# EAGLE design Smart Home (EAGLE 9.6.2)
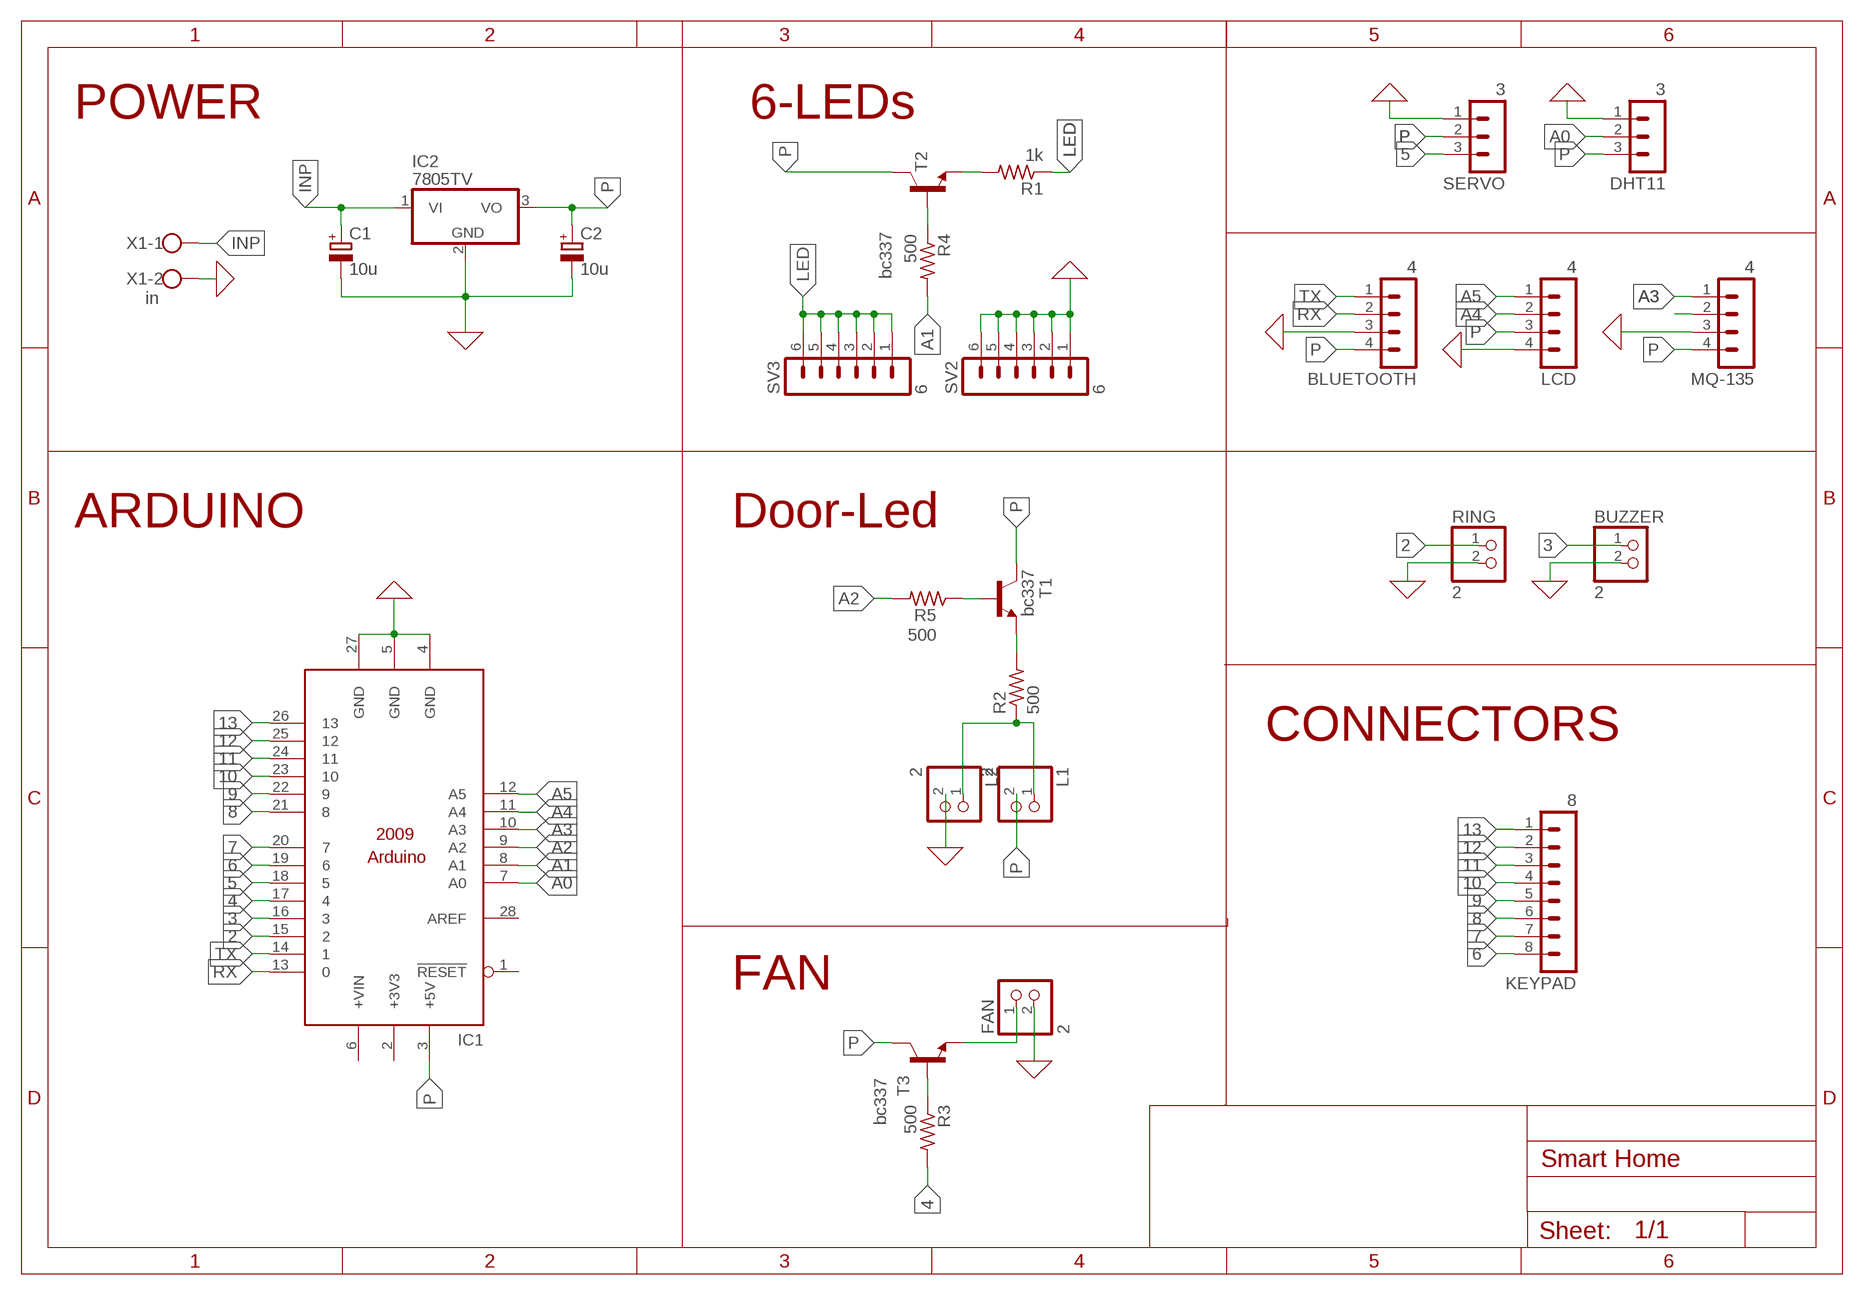
[diagram p0: schematic, sheet 1]

## Parts
BLUETOOTH  4  MA04-1  [MA04-1]
BUZZER  2  PINHD-1X2  [1X02]
C1  10u  CPOL-EUE2.5-6  [E2,5-6]
C2  10u  CPOL-EUE2.5-6  [E2,5-6]
DHT11  3  MA03-1  [MA03-1]
FAN  2  PINHD-1X2  [1X02]
IC1  uno  ARDUINO2009_12  [ARDUINO2009_2]
IC2  7805TV  [TO220V]
KEYPAD  8  MA08-1  [MA08-1]
L1  2  PINHD-1X2  [1X02]
L2  2  PINHD-1X2  [1X02]
LCD  4  MA04-1  [MA04-1]
MQ-135  4  MA04-1  [MA04-1]
R1  1k  R-US_0207/10  [0207/10]
R2  500  R-US_0207/10  [0207/10]
R3  500  R-US_0207/10  [0207/10]
R4  500  R-US_0207/10  [0207/10]
R5  500  R-US_0207/10  [0207/10]
RING  2  PINHD-1X2  [1X02]
SERVO  3  MA03-1  [MA03-1]
SV2  6  MA06-1  [MA06-1]
SV3  6  MA06-1  [MA06-1]
T1  bc337  BC337-16-NPN-TO92-CBE  [TO92-CBE]
T2  bc337  BC337-16-NPN-TO92-CBE  [TO92-CBE]
T3  bc337  BC337-16-NPN-TO92-CBE  [TO92-CBE]
X1  in  W237-102  [W237-102]

## Nets
0: BLUETOOTH.3 BUZZER.2 C1.- C2.- DHT11.1 FAN.2 IC1.4(GND) IC1.5(GND) IC1.27(GND) IC2.2(GND) L2.2 LCD.4 MQ-135.3 RING.2 SERVO.1 SV2.1 SV2.2 SV2.3 SV2.4 SV2.5 SV2.6 X1.2 ; supply symbol labelled GND
2: IC1.15 RING.1
3: BUZZER.1 IC1.16
4: IC1.17 R3.2
5: IC1.18 SERVO.3
6: IC1.19 KEYPAD.8
7: IC1.20 KEYPAD.7
8: IC1.21 KEYPAD.6
9: IC1.22 KEYPAD.5
10: IC1.23 KEYPAD.4
11: IC1.24 KEYPAD.3
12: IC1.25 KEYPAD.2
13: IC1.26 KEYPAD.1
A0: DHT11.2 IC1.7(A0)
A1: IC1.8(A1) R4.2
A2: IC1.9(A2) R5.2
A3: IC1.10(A3) MQ-135.1
A4: IC1.11(A4) LCD.2
A5: IC1.12(A5) LCD.1
INP: C1.+ IC2.1(VI) X1.1
L1: L1.1 L2.1 R2.1
LED: R1.1 SV3.1 SV3.2 SV3.3 SV3.4 SV3.5 SV3.6
N$1: R1.2 T2.E
N$2: R2.2 T1.E
N$3: FAN.1 T3.E
N$4: MQ-135.2
N$5: R5.1 T1.B
N$6: R4.1 T2.B
N$7: R3.1 T3.B
P: BLUETOOTH.4 C2.+ DHT11.3 IC1.3(+5V) IC2.3(VO) L1.2 LCD.3 MQ-135.4 SERVO.2 T1.C T2.C T3.C
RX: BLUETOOTH.2 IC1.13
TX: BLUETOOTH.1 IC1.14
Unconnected: IC1.1(!RESET) IC1.6(+VIN) IC1.28(AREF)

## Notes on the sheet
- POWER | 6-LEDs
- ARDUINO | Door-Led
- CONNECTORS
- FAN

## Power pins joined to a net without a drawn wire
+3V3: IC1.2(+3V3)

## Library data of the parts
BLUETOOTH LCD MQ-135 = con-lstb:MA04-1: PIN HEADER; OC_FARNELL: unknown; OC_NEWARK: unknown
BUZZER FAN L1 L2 RING = pinhead:PINHD-1X2: PIN HEADER
C1 C2 = rcl:CPOL-EU: POLARIZED CAPACITOR, European symbol; SPICEPREFIX: C
DHT11 SERVO = con-lstb:MA03-1: PIN HEADER; OC_FARNELL: unknown; OC_NEWARK: unknown
IC1 = arduino:ARDUINO2009_1: The Arduino Duemilanove ("2009") is a microcontroller board based on the ATmega168 or ATmega328. - 14 digital input/output pins (of which 6 can be used as PWM outputs) - 6 analog inputs, a 16 MHz crystal oscillator - USB connection - power jack - ISP header - reset button It contains everything needed to support the microcontroller; simply connect it to a computer with a USB cable or power it with a AC-to-DC adapter or battery to get started http://arduino.cc/en/Main/ArduinoBoardDuemilanove
IC2 = linear:78*: Positive VOLTAGE REGULATOR Source: http://cache.national.com/ds/LM/LM78L05.pdf http://www.fairchildsemi.com/ds/LM/LM7805.pdf
KEYPAD = con-lstb:MA08-1: PIN HEADER; OC_FARNELL: unknown; OC_NEWARK: unknown
R1-R5 = rcl:R-US_: RESISTOR, American symbol; SPICEPREFIX: R
SV2 SV3 = con-lstb:MA06-1: PIN HEADER; OC_FARNELL: unknown; OC_NEWARK: unknown
T1-T3 = transistor:*-NPN-: NPN Transistror BF959 corrected 2008.03.06
X1 = con-wago-500:W237-102: WAGO SCREW CLAMP; MPN: 237-102; OC_FARNELL: unknown; OC_NEWARK: 70K9898

## Net classes
0 default: width 1.397 mm

## Board
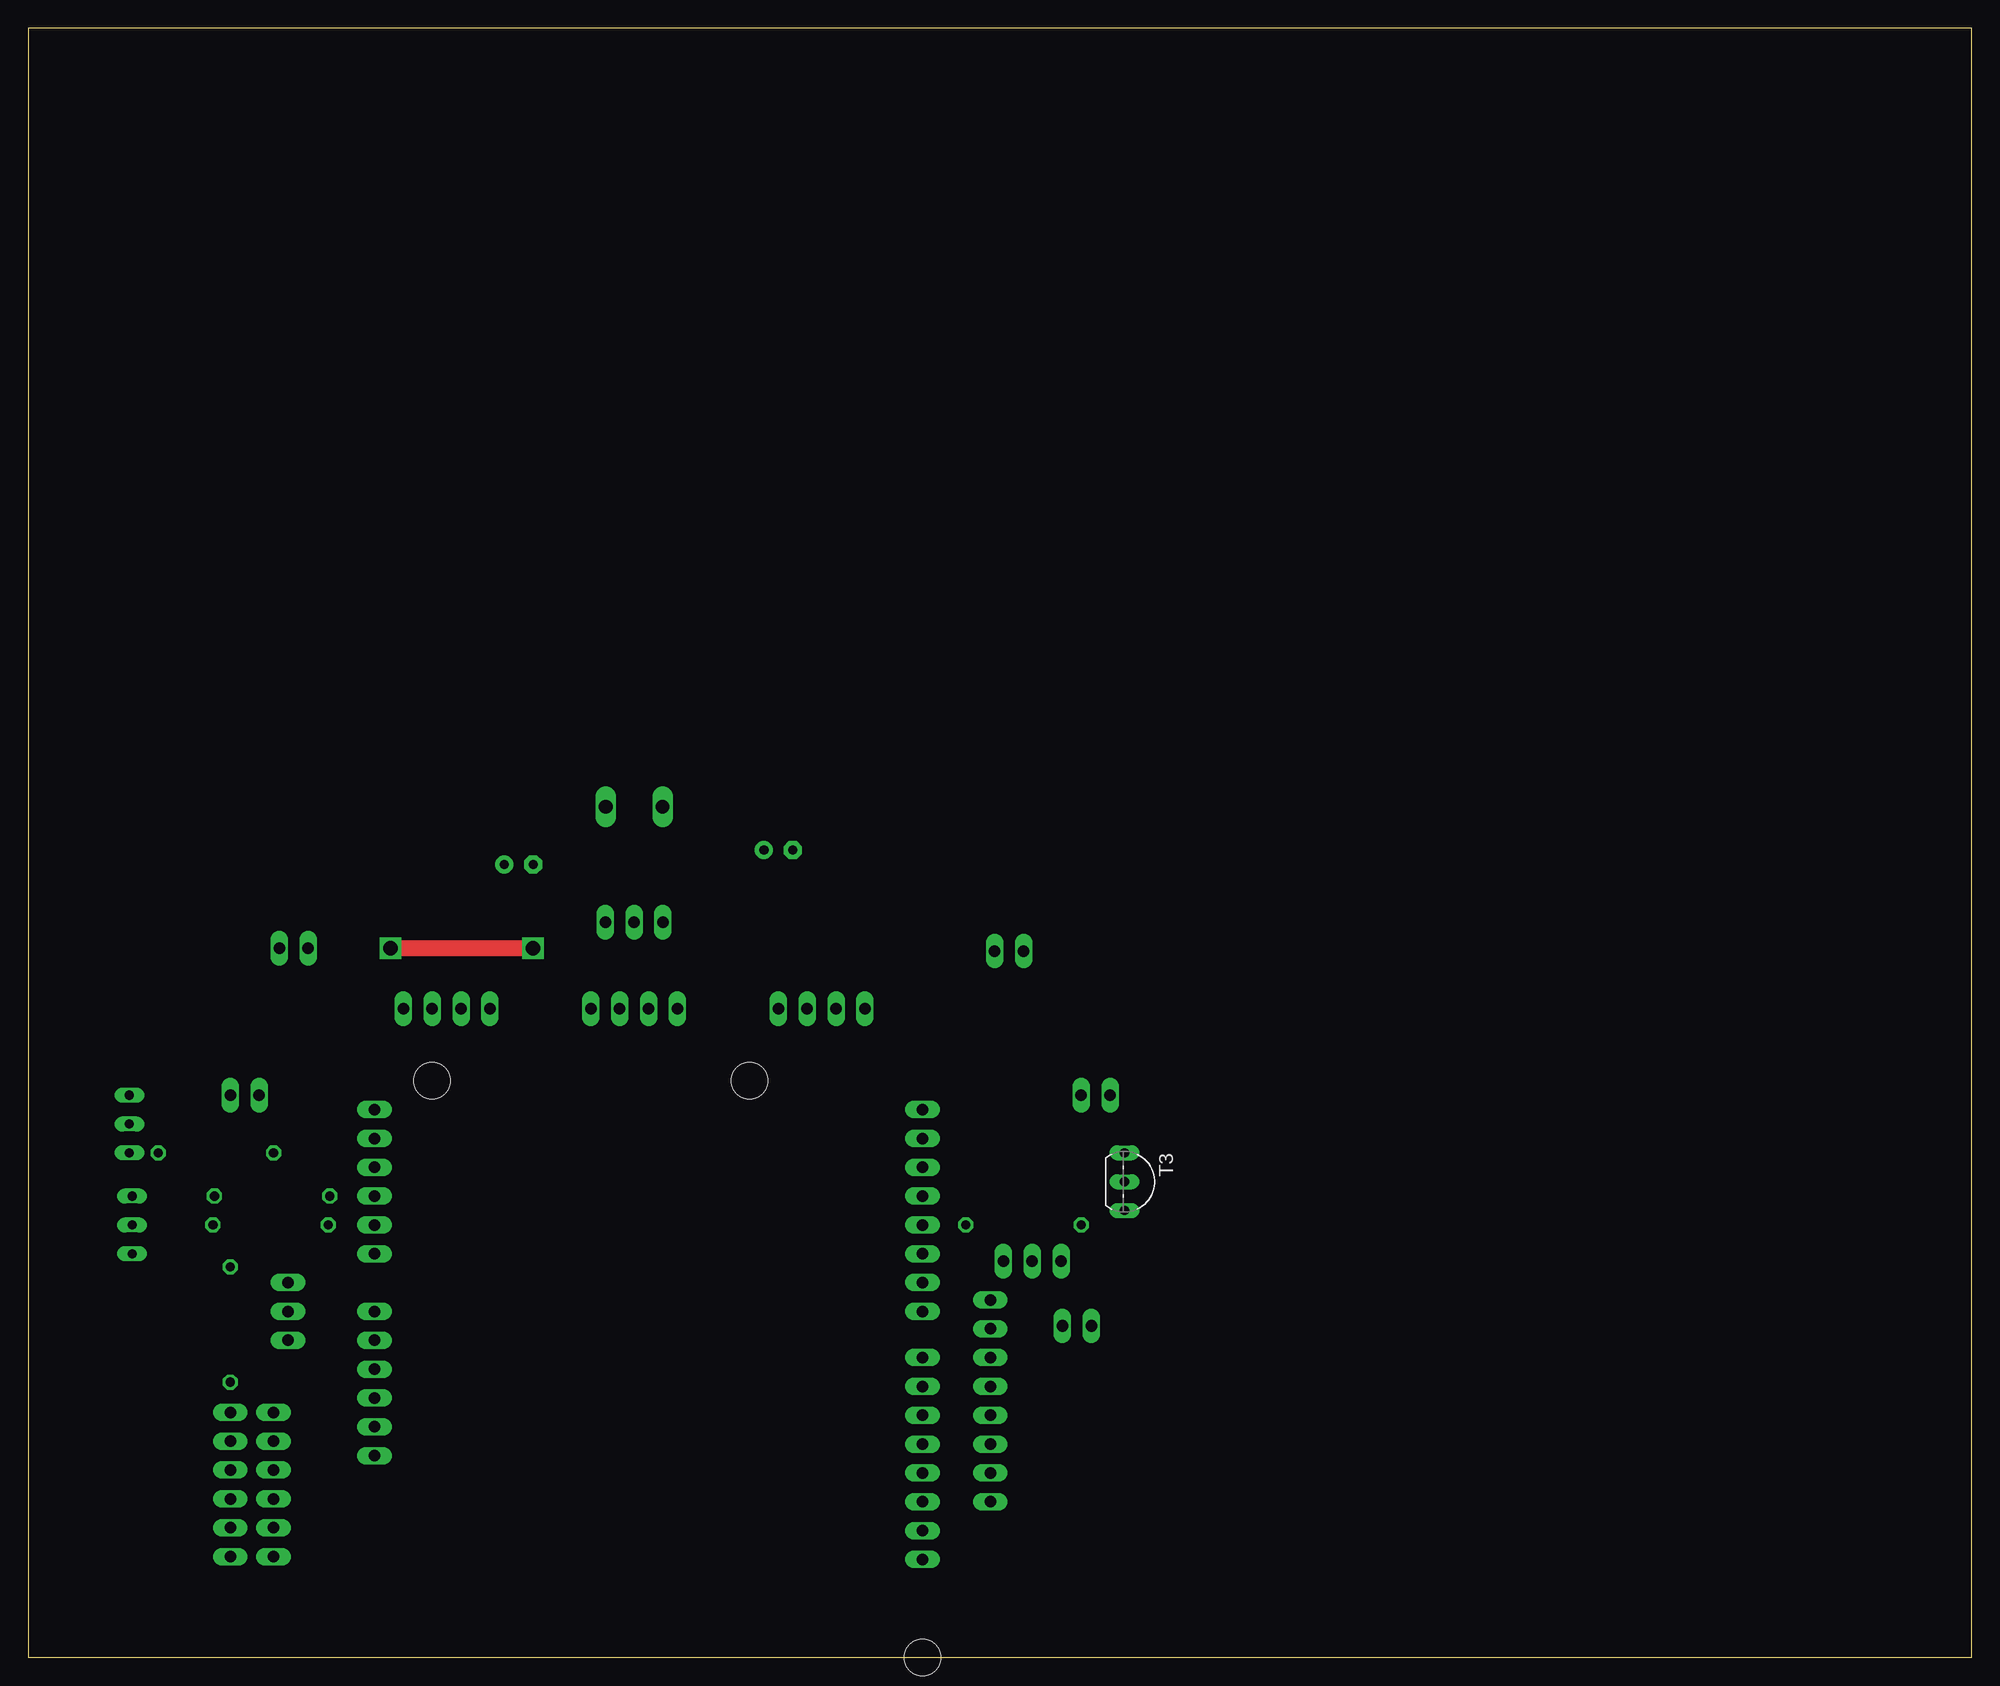
[diagram p1: board, top side]
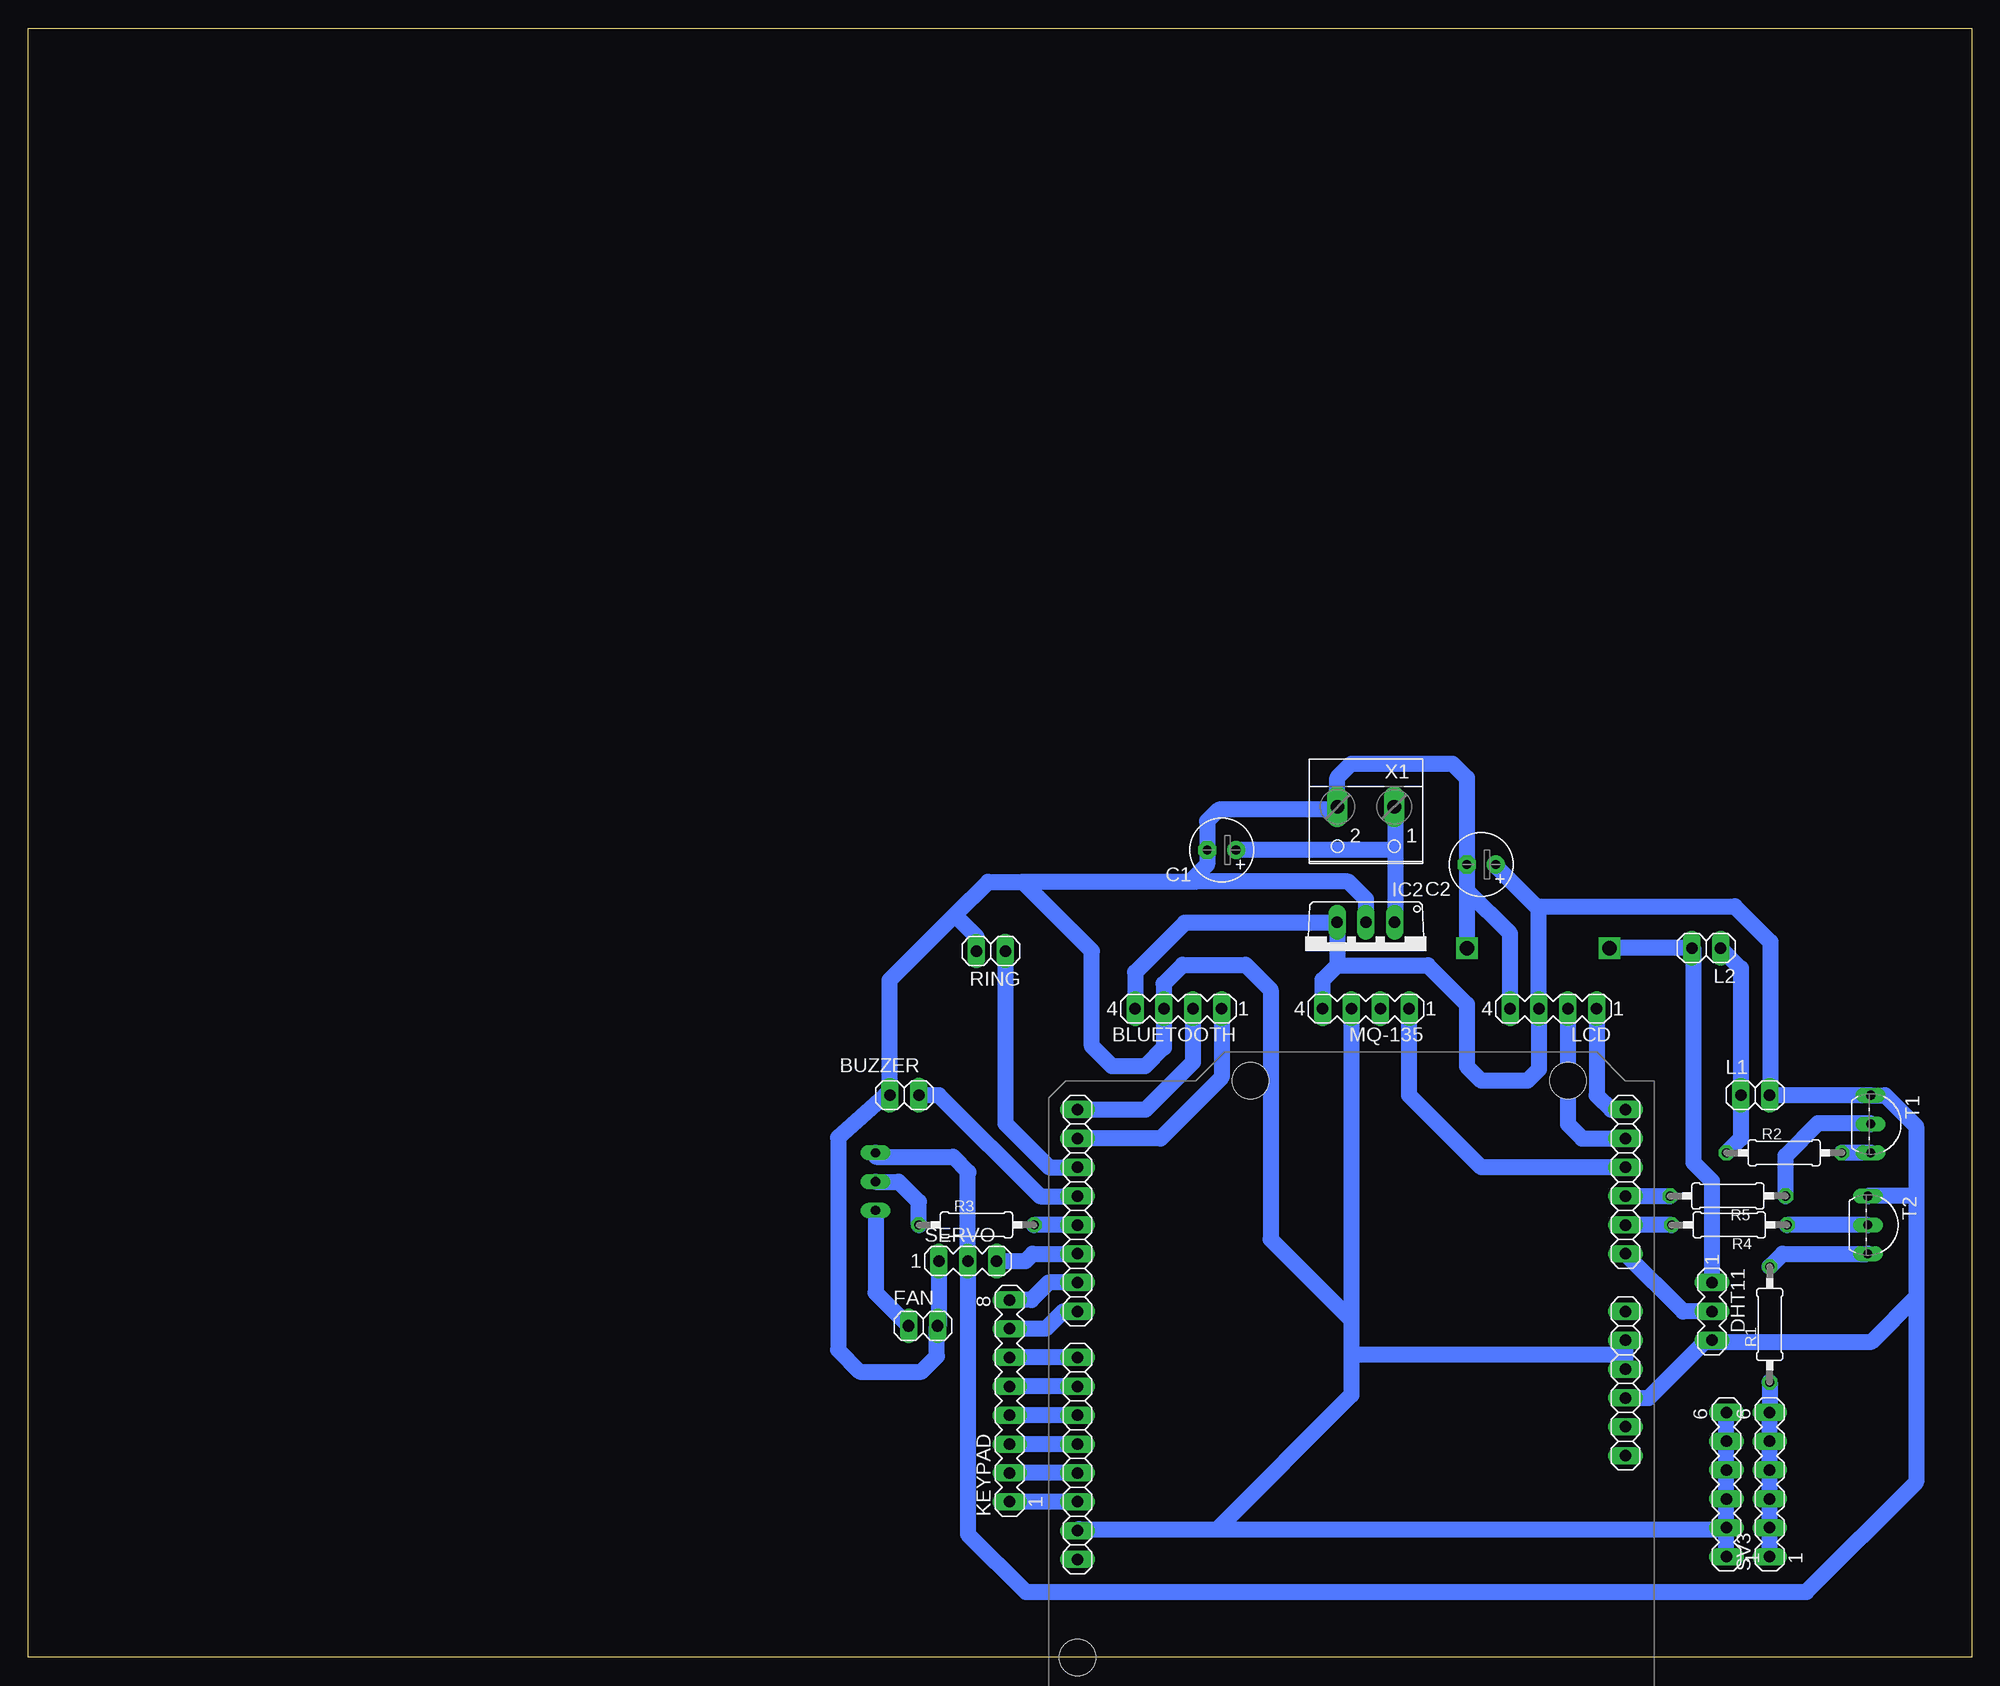
[diagram p2: board, bottom side, seen from below]

Size 171.12 x 143.5 mm. Coordinates in mm from the lower left corner, seen from the top.
Outline: 0,0 171.12,0 171.12,143.5 0,143.5 0,0
Copper layers (1*16): Top 0.035mm / dielectric 1.5mm / Bottom 0.035mm
Design rules "default *": minimum track width 55mil, minimum drill 0.35mm, track to track 10mil, track to pad 6mil, pad to pad 6mil, via to via 6mil, smd to smd 6mil, copper to edge 40mil, drill to drill 6mil, minimum pad ring 10mil, minimum via ring 8mil, stop-mask expansion 4mil, vias tented up to drill 0mil, thermal gap 10mil

### Footprints (pad centres in the part's own frame; a part is rotated, then mirrored left to right if it is on the bottom)
MA04-1 = drill 1.016 long: 1 -3.81,0; 2 -1.27,0; 3 1.27,0; 4 3.81,0
1X02 = drill 1.016 long: 1 -1.27,0; 2 1.27,0
E2,5-6 = drill 0.813 pad 1.6: + -1.27,0 | drill 0.813 pad 1.6 octagon: - 1.27,0
MA03-1 = drill 1.016 long: 1 -2.54,0; 2 0,0; 3 2.54,0
ARDUINO2009_2 = drill 1.016 long: 1 33.02,2.54; 2 35.56,2.54; 3 38.1,2.54; 4 40.64,2.54; 5 43.18,2.54; 6 45.72,2.54; 7 50.8,2.54; 8 53.34,2.54; 9 55.88,2.54; 10 58.42,2.54; 11 60.96,2.54; 12 63.5,2.54; 13 63.5,50.8; 14 60.96,50.8; 15 58.42,50.8; 16 55.88,50.8; 17 53.34,50.8; 18 50.8,50.8; 19 48.26,50.8; 20 45.72,50.8; 21 41.656,50.8; 22 39.116,50.8; 23 36.576,50.8; 24 34.036,50.8; 25 31.496,50.8; 26 28.956,50.8; 27 26.416,50.8; 28 23.876,50.8 | hole 3.2: 15.24,50.8; 66.04,35.56; 66.04,7.62
TO220V = drill 1.016 long: 1 -2.54,-2.54; 2 0,-2.54; 3 2.54,-2.54
MA08-1 = drill 1.016 long: 1 -8.89,0; 2 -6.35,0; 3 -3.81,0; 4 -1.27,0; 5 1.27,0; 6 3.81,0; 7 6.35,0; 8 8.89,0
0207/10 = drill 0.813 octagon: 1 -5.08,0; 2 5.08,0
MA06-1 = drill 1.016 long: 1 -6.35,0; 2 -3.81,0; 3 -1.27,0; 4 1.27,0; 5 3.81,0; 6 6.35,0
TO92-CBE = drill 0.813 long: B 0,0; C -2.54,0; E 2.54,0
W237-102 = drill 1.194 long: 1 -2.5,-1.27; 2 2.5,-1.27

### Placement (x,y rotation side)
BLUETOOTH  69.85,57.15 180 bottom
BUZZER  93.98,49.53 180 bottom
C1  66.04,71.12 180 bottom
C2  43.18,69.85 180 bottom
DHT11  22.86,30.48 270 bottom
FAN  92.33,29.21 0 bottom
IC1  27.94,-15.24 90 bottom
IC2  53.34,62.23 180 bottom
KEYPAD  84.71,22.61 90 bottom
L1  19.05,49.53 0 bottom
L2  23.37,62.48 180 bottom
LCD  36.83,57.15 180 bottom
MQ-135  53.34,57.15 180 bottom
R1  17.78,29.34 90 bottom
R2  16.51,44.45 0 bottom
R3  87.63,38.1 0 bottom
R4  21.34,38.1 180 bottom
R5  21.46,40.64 180 bottom
RING  86.36,62.23 180 bottom
SERVO  88.39,34.92 0 bottom
SV2  21.59,15.24 90 bottom
SV3  17.78,15.24 90 bottom
T1  8.89,46.99 270 bottom
T2  9.14,38.1 270 bottom
T3  96.52,41.91 270 top
X1  53.34,73.66 180 bottom

### Tracks (layer width: path | path; a pad name or v marks a point on that pad's centre or on a via)
0  (via drill 1.27)
  Top 1.397: v31.88,62.48 v44.45,62.48
  Bottom 1.397: DHT11.1 22.86,41.94 24.51,43.59 24.51,62.36 L2.2 v31.88,62.48 | SERVO.1 90.93,29.34 FAN.2 91.11,29.16 91.11,26.54 92.48,25.17 97.89,25.17 99.82,27.1 99.82,45.8 95.67,49.53 BUZZER.2 95.3,49.58 95.3,59.64 89.53,65.41 | 54.61,29.72 61.72,36.83 61.72,58.8 63.93,61.01 69.47,61.01 71.14,59.33 71.14,57.17 BLUETOOTH.3 71.12,53.72 72.77,52.07 75.69,52.07 77.47,53.85 77.47,62.23 83.57,68.33 | IC1.27 78.61,11.3 66.42,11.3 | 66.42,11.3 54.61,23.11 54.61,26.67 | 66.42,11.3 21.72,11.3 SV2.2 | IC2.2 53.34,66.8 54.89,68.35 68.35,68.35 68.52,68.52 | 89.53,65.41 86.61,68.33 83.57,68.33 | RING.2 87.63,63.5 89.53,65.41 | 68.52,68.52 68.71,68.33 83.57,68.33 | 68.52,68.52 68.58,68.58 67.31,69.85 C1.- 67.31,73.66 66.29,74.68 55.93,74.68 X1.2 55.84,77.51 54.61,78.74 45.72,78.74 44.45,77.47 C2.- 44.45,67.56 | MQ-135.3 54.61,29.72 | LCD.4 40.64,63.75 44.45,67.56 | SV2.1 SV2.2 | SV2.2 SV2.3 SV2.4 SV2.5 SV2.6 | 44.45,67.56 v44.45,62.48 | IC1.5 30.48,26.67 | 30.48,26.67 IC1.4 | 54.61,29.72 54.61,26.67 | 30.48,26.67 54.61,26.67
2
  Bottom 1.397: RING.1 85.09,47.04 81.23,43.18 IC1.15
3
  Bottom 1.397: IC1.16 78.77,40.62 82.02,40.62 90.93,49.53 BUZZER.1
4
  Bottom 1.397: IC1.17 R3.2
5
  Bottom 1.397: SERVO.3 83.31,34.92 82.68,35.56 IC1.18
6
  Bottom 1.397: IC1.19 81.28,33.02 82.8,31.5 KEYPAD.8
7
  Bottom 1.397: IC1.20 80.01,30.48 81.53,28.96 KEYPAD.7
8
  Bottom 1.397: IC1.21 KEYPAD.6
9
  Bottom 1.397: IC1.22 KEYPAD.5
10
  Bottom 1.397: IC1.23 KEYPAD.4
11
  Bottom 1.397: IC1.24 KEYPAD.3
12
  Bottom 1.397: IC1.25 KEYPAD.2
13
  Bottom 1.397: IC1.26 KEYPAD.1
A0
  Bottom 1.397: DHT11.2 25.4,30.48 IC1.7
A1
  Bottom 1.397: R4.2 IC1.8
A2
  Bottom 1.397: IC1.9 R5.2
A3
  Bottom 1.397: MQ-135.1 49.53,49.53 43.18,43.18 IC1.10
A4
  Bottom 1.397: IC1.11 34.29,45.72 35.56,46.99 LCD.2
A5
  Bottom 1.397: LCD.1 33.02,49.53 31.75,48.26 IC1.12
INP
  Bottom 1.397: 50.75,71.12 50.75,74.89 X1.1 | 50.75,71.12 50.75,64.83 IC2.1 | 50.75,71.12 C1.+
L1
  Bottom 1.397: L2.1 20.33,60.71 20.33,49.56 L1.1 20.32,45.72 R2.1
LED
  Bottom 1.397: SV3.1 SV3.2 SV3.3 SV3.4 SV3.5 SV3.6 R1.1
N$1
  Bottom 1.397: R1.2 16.64,35.56 T2.E
N$2
  Bottom 1.397: T1.E R2.2
N$3
  Bottom 1.397: FAN.1 96.52,32.13 T3.E
N$5
  Bottom 1.397: R5.1 16.38,44.2 13.51,47.07 8.97,47.07 T1.B
N$6
  Bottom 1.397: T2.B R4.1
N$7
  Bottom 1.397: T3.B 94.49,41.91 92.71,40.13 R3.1
P
  Bottom 1.397: BLUETOOTH.4 73.66,60.35 69.29,64.72 55.93,64.72 IC2.3 55.88,60.96 | T3.C 96.47,44.09 89.69,44.09 88.34,42.75 88.39,42.7 SERVO.2 88.39,10.87 83.29,5.77 14.55,5.77 4.88,15.44 4.88,31.75 | 4.88,40.64 4.88,46.79 7.62,49.53 T1.C L1.2 17.73,49.58 17.73,63.04 20.85,66.17 38.35,66.17 | 4.88,40.64 4.88,31.75 | 4.88,31.75 8.81,27.81 22.86,27.81 | MQ-135.4 57.15,59.69 55.88,60.96 | C2.+ 41.91,69.72 38.35,66.17 | 38.35,66.17 38.1,65.91 LCD.3 38.1,51.82 39.12,50.8 43.18,50.8 44.45,52.07 44.45,57.53 47.88,60.96 55.88,60.96 | DHT11.3 22.86,27.81 | IC1.3 28.45,22.86 23.5,27.81 22.86,27.81 | 4.88,40.64 T2.C
RX
  Bottom 1.397: IC1.13 72.75,48.26 68.58,52.43 BLUETOOTH.2
TX
  Bottom 1.397: IC1.14 71.42,45.72 66.04,51.1 BLUETOOTH.1